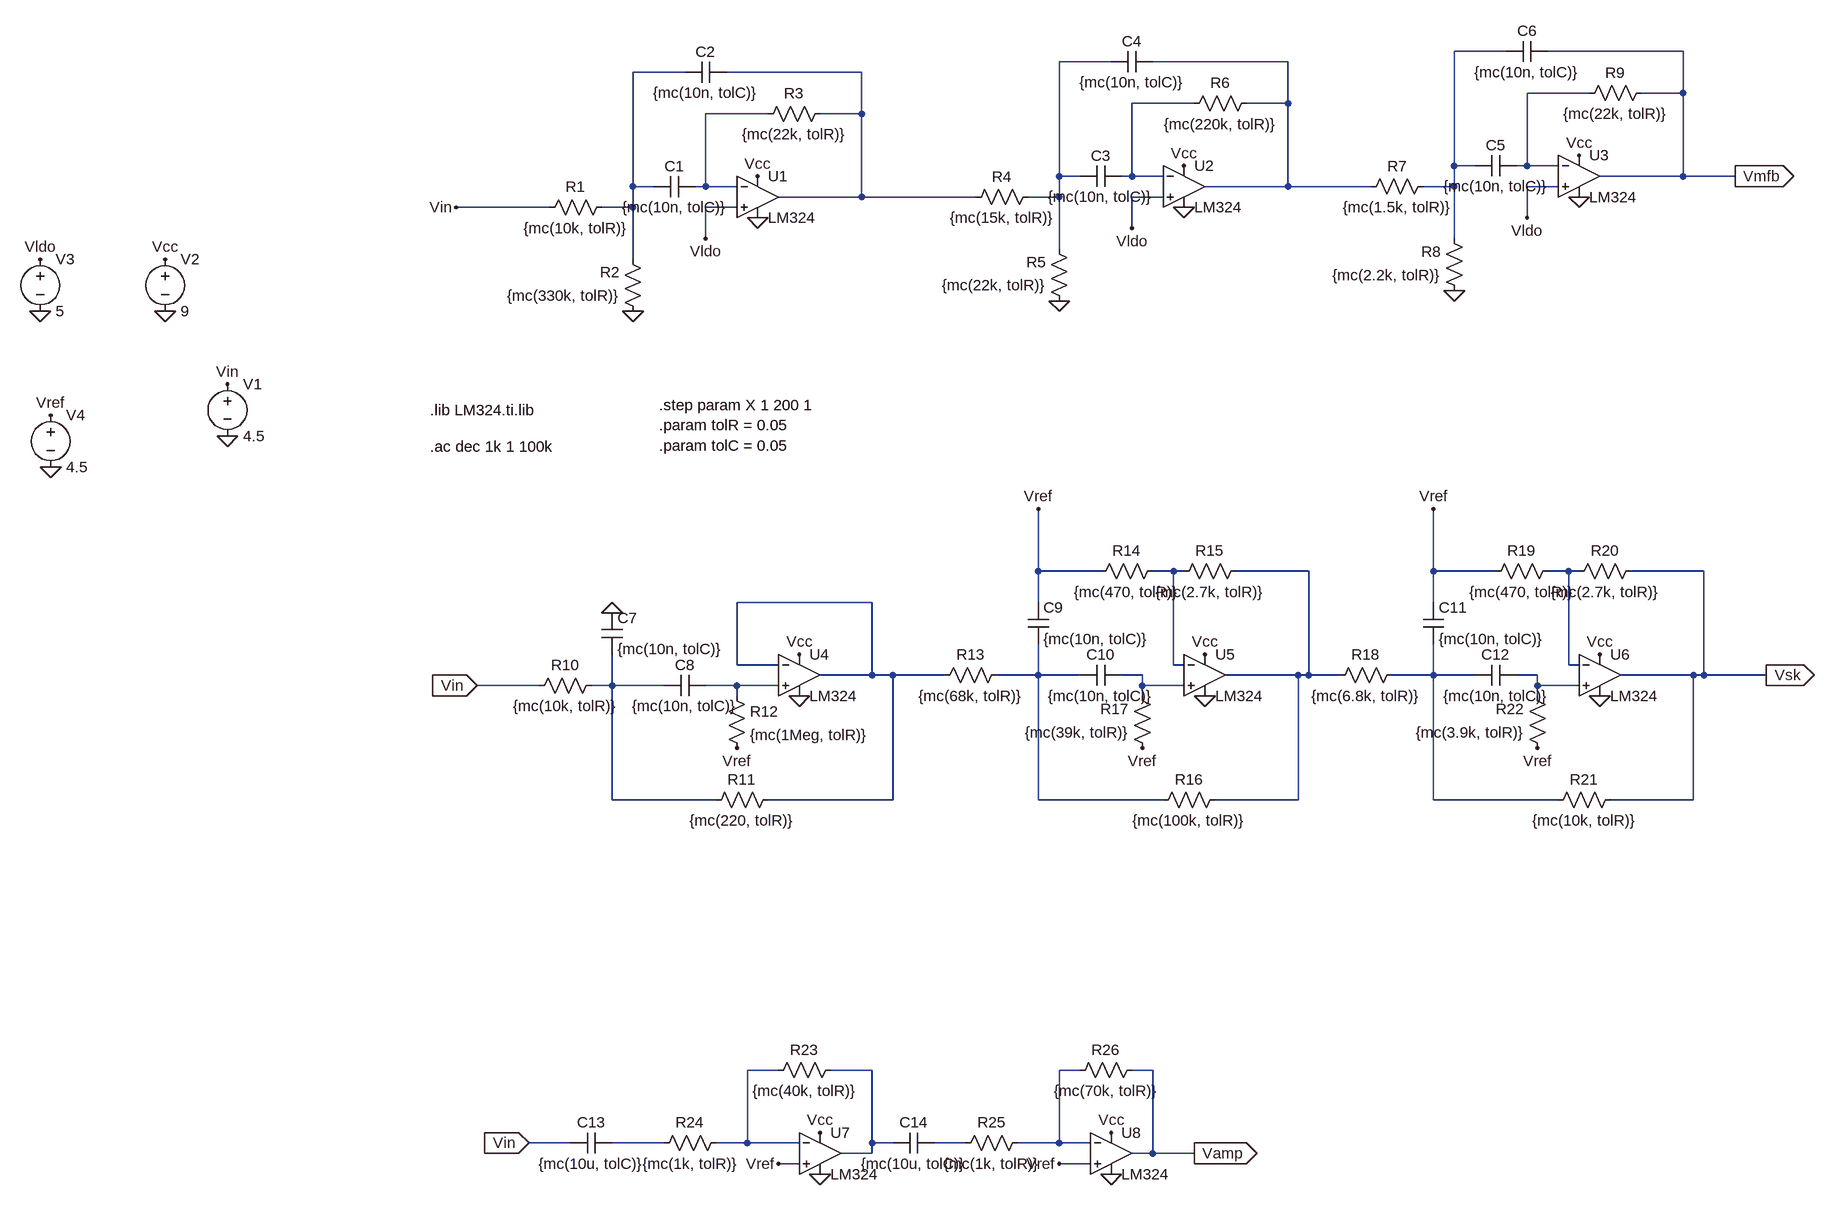
[diagram p0: schematic Draft2.asc]
Draft2.asc, the LTspice schematic file:
Version 4
SHEET 1 1588 1872
WIRE 1088 112 1008 112
WIRE 1360 112 1152 112
WIRE 480 128 400 128
WIRE 752 128 544 128
WIRE -176 144 -256 144
WIRE 96 144 -112 144
WIRE 1216 176 1120 176
WIRE 1360 176 1360 112
WIRE 1360 176 1296 176
WIRE 608 192 512 192
WIRE 752 192 752 128
WIRE 752 192 688 192
WIRE -48 208 -144 208
WIRE 96 208 96 144
WIRE 96 208 32 208
WIRE 1008 288 1008 112
WIRE 1040 288 1008 288
WIRE 1120 288 1120 176
WIRE 1120 288 1104 288
WIRE 1168 288 1120 288
WIRE 400 304 400 128
WIRE 432 304 400 304
WIRE 512 304 512 192
WIRE 512 304 496 304
WIRE 560 304 512 304
WIRE 1360 304 1360 176
WIRE 1360 304 1232 304
WIRE 1440 304 1360 304
WIRE -256 320 -256 144
WIRE -224 320 -256 320
WIRE -144 320 -144 208
WIRE -144 320 -160 320
WIRE -96 320 -144 320
WIRE 752 320 752 192
WIRE 752 320 624 320
WIRE 880 320 752 320
WIRE 1008 320 1008 288
WIRE 1008 320 960 320
WIRE 1168 320 1120 320
WIRE 96 336 96 208
WIRE 96 336 -32 336
WIRE 272 336 96 336
WIRE 400 336 400 304
WIRE 400 336 352 336
WIRE 560 336 512 336
WIRE -384 352 -528 352
WIRE -256 352 -256 320
WIRE -256 352 -304 352
WIRE -96 352 -144 352
WIRE 1120 368 1120 320
WIRE 512 384 512 336
WIRE -144 400 -144 352
WIRE 1008 400 1008 320
WIRE 400 416 400 336
WIRE -256 432 -256 352
WIRE 368 912 368 816
WIRE 464 912 368 912
WIRE 576 912 544 912
WIRE 592 912 576 912
WIRE 784 912 672 912
WIRE 976 912 976 816
WIRE 1072 912 976 912
WIRE 1184 912 1152 912
WIRE 1200 912 1184 912
WIRE 1392 912 1280 912
WIRE 112 960 -96 960
WIRE 368 960 368 912
WIRE 976 960 976 912
WIRE -96 1056 -96 960
WIRE -32 1056 -96 1056
WIRE 576 1056 576 912
WIRE 592 1056 576 1056
WIRE 1184 1056 1184 912
WIRE 1200 1056 1184 1056
WIRE 112 1072 112 960
WIRE 112 1072 32 1072
WIRE 144 1072 112 1072
WIRE 224 1072 144 1072
WIRE 368 1072 368 1024
WIRE 368 1072 304 1072
WIRE 432 1072 368 1072
WIRE 528 1072 496 1072
WIRE 768 1072 656 1072
WIRE 784 1072 784 912
WIRE 784 1072 768 1072
WIRE 832 1072 784 1072
WIRE 976 1072 976 1024
WIRE 976 1072 912 1072
WIRE 1040 1072 976 1072
WIRE 1136 1072 1104 1072
WIRE 1376 1072 1264 1072
WIRE 1392 1072 1392 912
WIRE 1392 1072 1376 1072
WIRE 1488 1072 1392 1072
WIRE -400 1088 -496 1088
WIRE -288 1088 -288 1040
WIRE -288 1088 -320 1088
WIRE -208 1088 -288 1088
WIRE -96 1088 -144 1088
WIRE -32 1088 -96 1088
WIRE 528 1088 528 1072
WIRE 592 1088 528 1088
WIRE 1136 1088 1136 1072
WIRE 1200 1088 1136 1088
WIRE -96 1104 -96 1088
WIRE 528 1104 528 1088
WIRE 1136 1104 1136 1088
WIRE -288 1264 -288 1088
WIRE -128 1264 -288 1264
WIRE 144 1264 144 1072
WIRE 144 1264 -48 1264
WIRE 368 1264 368 1072
WIRE 560 1264 368 1264
WIRE 768 1264 768 1072
WIRE 768 1264 640 1264
WIRE 976 1264 976 1072
WIRE 1168 1264 976 1264
WIRE 1376 1264 1376 1072
WIRE 1376 1264 1248 1264
WIRE -32 1680 -80 1680
WIRE 112 1680 48 1680
WIRE 432 1680 400 1680
WIRE 544 1680 512 1680
WIRE -352 1792 -416 1792
WIRE -208 1792 -288 1792
WIRE -80 1792 -80 1680
WIRE -80 1792 -128 1792
WIRE 0 1792 -80 1792
WIRE 112 1792 112 1680
WIRE 144 1792 112 1792
WIRE 256 1792 208 1792
WIRE 400 1792 400 1680
WIRE 400 1792 336 1792
WIRE 448 1792 400 1792
WIRE 112 1808 112 1792
WIRE 112 1808 64 1808
WIRE 544 1808 544 1680
WIRE 544 1808 512 1808
WIRE 608 1808 544 1808
WIRE 0 1824 -32 1824
WIRE 448 1824 400 1824
FLAG -64 304 Vcc
FLAG -64 368 0
FLAG 592 288 Vcc
FLAG 592 352 0
FLAG 1200 272 Vcc
FLAG 1200 336 0
FLAG 1440 304 Vmfb
IOPIN 1440 304 Out
FLAG 1008 480 0
FLAG 400 496 0
FLAG -256 512 0
FLAG -144 400 Vldo
FLAG 512 384 Vldo
FLAG 1120 368 Vldo
FLAG -880 704 0
FLAG -288 976 0
FLAG 0 1104 0
FLAG 0 1040 Vcc
FLAG 1488 1072 Vsk
IOPIN 1488 1072 Out
FLAG -496 1088 Vin
IOPIN -496 1088 In
FLAG 624 1104 0
FLAG 624 1040 Vcc
FLAG 1232 1104 0
FLAG 1232 1040 Vcc
FLAG 368 816 Vref
FLAG 976 816 Vref
FLAG 528 1184 Vref
FLAG -96 1184 Vref
FLAG 1136 1184 Vref
FLAG -976 512 0
FLAG -976 432 Vcc
FLAG -1168 512 0
FLAG -1168 432 Vldo
FLAG -1152 752 0
FLAG -1152 672 Vref
FLAG -880 624 Vin
FLAG -528 352 Vin
FLAG 32 1840 0
FLAG 480 1840 0
FLAG 32 1776 Vcc
FLAG 480 1776 Vcc
FLAG -32 1824 Vref
FLAG 400 1824 Vref
FLAG -416 1792 Vin
IOPIN -416 1792 In
FLAG 608 1808 Vamp
IOPIN 608 1808 Out
SYMBOL res -288 336 R90
WINDOW 0 0 56 VBottom 2
WINDOW 3 32 56 VTop 2
SYMATTR InstName R1
SYMATTR Value {mc(10k, tolR)}
SYMBOL res -240 528 R180
WINDOW 0 36 76 Left 2
WINDOW 3 36 40 Left 2
SYMATTR InstName R2
SYMATTR Value {mc(330k, tolR)}
SYMBOL cap -160 304 R90
WINDOW 0 0 32 VBottom 2
WINDOW 3 32 32 VTop 2
SYMATTR InstName C1
SYMATTR Value {mc(10n, tolC)}
SYMBOL res 48 192 R90
WINDOW 0 0 56 VBottom 2
WINDOW 3 32 56 VTop 2
SYMATTR InstName R3
SYMATTR Value {mc(22k, tolR)}
SYMBOL cap -112 128 R90
WINDOW 0 0 32 VBottom 2
WINDOW 3 32 32 VTop 2
SYMATTR InstName C2
SYMATTR Value {mc(10n, tolC)}
SYMBOL res 368 320 R90
WINDOW 0 0 56 VBottom 2
WINDOW 3 32 56 VTop 2
SYMATTR InstName R4
SYMATTR Value {mc(15k, tolR)}
SYMBOL res 416 512 R180
WINDOW 0 36 76 Left 2
WINDOW 3 36 40 Left 2
SYMATTR InstName R5
SYMATTR Value {mc(22k, tolR)}
SYMBOL cap 496 288 R90
WINDOW 0 0 32 VBottom 2
WINDOW 3 32 32 VTop 2
SYMATTR InstName C3
SYMATTR Value {mc(10n, tolC)}
SYMBOL res 704 176 R90
WINDOW 0 0 56 VBottom 2
WINDOW 3 32 56 VTop 2
SYMATTR InstName R6
SYMATTR Value {mc(220k, tolR)}
SYMBOL cap 544 112 R90
WINDOW 0 0 32 VBottom 2
WINDOW 3 32 32 VTop 2
SYMATTR InstName C4
SYMATTR Value {mc(10n, tolC)}
SYMBOL res 976 304 R90
WINDOW 0 0 56 VBottom 2
WINDOW 3 32 56 VTop 2
SYMATTR InstName R7
SYMATTR Value {mc(1.5k, tolR)}
SYMBOL res 1024 496 R180
WINDOW 0 36 76 Left 2
WINDOW 3 36 40 Left 2
SYMATTR InstName R8
SYMATTR Value {mc(2.2k, tolR)}
SYMBOL cap 1104 272 R90
WINDOW 0 0 32 VBottom 2
WINDOW 3 32 32 VTop 2
SYMATTR InstName C5
SYMATTR Value {mc(10n, tolC)}
SYMBOL res 1312 160 R90
WINDOW 0 0 56 VBottom 2
WINDOW 3 32 56 VTop 2
SYMATTR InstName R9
SYMATTR Value {mc(22k, tolR)}
SYMBOL cap 1152 96 R90
WINDOW 0 0 32 VBottom 2
WINDOW 3 32 32 VTop 2
SYMATTR InstName C6
SYMATTR Value {mc(10n, tolC)}
SYMBOL opamp2 -64 272 R0
SYMATTR InstName U1
SYMATTR Value LM324
SYMBOL opamp2 592 256 R0
SYMATTR InstName U2
SYMATTR Value LM324
SYMBOL opamp2 1200 240 R0
SYMATTR InstName U3
SYMATTR Value LM324
SYMBOL Voltage -880 608 R0
SYMATTR InstName V1
SYMATTR Value 4.5
SYMATTR Value2 AC 1 0
SYMBOL Res -304 1072 R90
WINDOW 0 0 56 VBottom 2
WINDOW 3 32 56 VTop 2
SYMATTR InstName R10
SYMATTR Value {mc(10k, tolR)}
SYMBOL Res -32 1248 R90
WINDOW 0 0 56 VBottom 2
WINDOW 3 32 56 VTop 2
SYMATTR InstName R11
SYMATTR Value {mc(220, tolR)}
SYMBOL Cap -304 976 R0
SYMATTR InstName C7
SYMATTR Value {mc(10n, tolC)}
SYMBOL Cap -144 1072 R90
WINDOW 0 0 32 VBottom 2
WINDOW 3 32 32 VTop 2
SYMATTR InstName C8
SYMATTR Value {mc(10n, tolC)}
SYMBOL Res -112 1088 R0
SYMATTR InstName R12
SYMATTR Value {mc(1Meg, tolR)}
SYMBOL Res 320 1056 R90
WINDOW 0 0 56 VBottom 2
WINDOW 3 32 56 VTop 2
SYMATTR InstName R13
SYMATTR Value {mc(68k, tolR)}
SYMBOL Res 560 896 R90
WINDOW 0 0 56 VBottom 2
WINDOW 3 32 56 VTop 2
SYMATTR InstName R14
SYMATTR Value {mc(470, tolR)}
SYMBOL Res 688 896 R90
WINDOW 0 0 56 VBottom 2
WINDOW 3 32 56 VTop 2
SYMATTR InstName R15
SYMATTR Value {mc(2.7k, tolR)}
SYMBOL Res 656 1248 R90
WINDOW 0 0 56 VBottom 2
WINDOW 3 32 56 VTop 2
SYMATTR InstName R16
SYMATTR Value {mc(100k, tolR)}
SYMBOL Res 544 1200 R180
WINDOW 0 36 76 Left 2
WINDOW 3 36 40 Left 2
SYMATTR InstName R17
SYMATTR Value {mc(39k, tolR)}
SYMBOL Cap 352 960 R0
SYMATTR InstName C9
SYMATTR Value {mc(10n, tolC)}
SYMBOL Cap 496 1056 R90
WINDOW 0 0 32 VBottom 2
WINDOW 3 32 32 VTop 2
SYMATTR InstName C10
SYMATTR Value {mc(10n, tolC)}
SYMBOL Res 928 1056 R90
WINDOW 0 0 56 VBottom 2
WINDOW 3 32 56 VTop 2
SYMATTR InstName R18
SYMATTR Value {mc(6.8k, tolR)}
SYMBOL Res 1168 896 R90
WINDOW 0 0 56 VBottom 2
WINDOW 3 32 56 VTop 2
SYMATTR InstName R19
SYMATTR Value {mc(470, tolR)}
SYMBOL Res 1296 896 R90
WINDOW 0 0 56 VBottom 2
WINDOW 3 32 56 VTop 2
SYMATTR InstName R20
SYMATTR Value {mc(2.7k, tolR)}
SYMBOL Res 1264 1248 R90
WINDOW 0 0 56 VBottom 2
WINDOW 3 32 56 VTop 2
SYMATTR InstName R21
SYMATTR Value {mc(10k, tolR)}
SYMBOL Res 1152 1200 R180
WINDOW 0 36 76 Left 2
WINDOW 3 36 40 Left 2
SYMATTR InstName R22
SYMATTR Value {mc(3.9k, tolR)}
SYMBOL Cap 960 960 R0
SYMATTR InstName C11
SYMATTR Value {mc(10n, tolC)}
SYMBOL Cap 1104 1056 R90
WINDOW 0 0 32 VBottom 2
WINDOW 3 32 32 VTop 2
SYMATTR InstName C12
SYMATTR Value {mc(10n, tolC)}
SYMBOL opamp2 0 1008 R0
SYMATTR InstName U4
SYMATTR Value LM324
SYMBOL opamp2 624 1008 R0
SYMATTR InstName U5
SYMATTR Value LM324
SYMBOL opamp2 1232 1008 R0
SYMATTR InstName U6
SYMATTR Value LM324
SYMBOL voltage -976 416 R0
WINDOW 123 0 0 Left 0
WINDOW 39 0 0 Left 0
SYMATTR InstName V2
SYMATTR Value 9
SYMBOL Voltage -1168 416 R0
SYMATTR InstName V3
SYMATTR Value 5
SYMBOL Voltage -1152 656 R0
SYMATTR InstName V4
SYMATTR Value 4.5
SYMBOL Res 64 1664 R90
WINDOW 0 0 56 VBottom 2
WINDOW 3 32 56 VTop 2
SYMATTR InstName R23
SYMATTR Value {mc(40k, tolR)}
SYMBOL Res -112 1776 R90
WINDOW 0 0 56 VBottom 2
WINDOW 3 32 56 VTop 2
SYMATTR InstName R24
SYMATTR Value {mc(1k, tolR)}
SYMBOL Res 352 1776 R90
WINDOW 0 0 56 VBottom 2
WINDOW 3 32 56 VTop 2
SYMATTR InstName R25
SYMATTR Value {mc(1k, tolR)}
SYMBOL Res 528 1664 R90
WINDOW 0 0 56 VBottom 2
WINDOW 3 32 56 VTop 2
SYMATTR InstName R26
SYMATTR Value {mc(70k, tolR)}
SYMBOL Cap -288 1776 R90
WINDOW 0 0 32 VBottom 2
WINDOW 3 32 32 VTop 2
SYMATTR InstName C13
SYMATTR Value {mc(10u, tolC)}
SYMBOL Cap 208 1776 R90
WINDOW 0 0 32 VBottom 2
WINDOW 3 32 32 VTop 2
SYMATTR InstName C14
SYMATTR Value {mc(10u, tolC)}
SYMBOL opamp2 32 1744 R0
SYMATTR InstName U7
SYMATTR Value LM324
SYMBOL opamp2 480 1744 R0
SYMATTR InstName U8
SYMATTR Value LM324
TEXT -568 664 Left 2 !.lib LM324.ti.lib
TEXT -568 720 Left 2 !.ac dec 1k 1 100k
TEXT -216 656 Left 2 !.step param X 1 200 1\n.param tolR = 0.05\n.param tolC = 0.05

The netlist it stands for:
* Draft2.asc
R1 N004 Vin {mc(10k, tolR)}
R2 0 N004 {mc(330k, tolR)}
C1 N008 N004 {mc(10n, tolC)}
R3 N005 N008 {mc(22k, tolR)}
C2 N005 N004 {mc(10n, tolC)}
R4 N002 N005 {mc(15k, tolR)}
R5 0 N002 {mc(22k, tolR)}
C3 N007 N002 {mc(10n, tolC)}
R6 N003 N007 {mc(220k, tolR)}
C4 N003 N002 {mc(10n, tolC)}
R7 N001 N003 {mc(1.5k, tolR)}
R8 0 N001 {mc(2.2k, tolR)}
C5 N006 N001 {mc(10n, tolC)}
R9 Vmfb N006 {mc(22k, tolR)}
C6 Vmfb N001 {mc(10n, tolC)}
XU1 Vldo N008 Vcc 0 N005 LM324  ; pins In+ In- V+ V- OUT
XU2 Vldo N007 Vcc 0 N003 LM324  ; pins In+ In- V+ V- OUT
XU3 Vldo N006 Vcc 0 Vmfb LM324  ; pins In+ In- V+ V- OUT
V1 Vin 0 4.5 AC 1 0
R10 N017 Vin {mc(10k, tolR)}
R11 N012 N017 {mc(220, tolR)}
C7 0 N017 {mc(10n, tolC)}
C8 N018 N017 {mc(10n, tolC)}
R12 N018 Vref {mc(1Meg, tolR)}
R13 N013 N012 {mc(68k, tolR)}
R14 N009 Vref {mc(470, tolR)}
R15 N010 N009 {mc(2.7k, tolR)}
R16 N010 N013 {mc(100k, tolR)}
R17 Vref N014 {mc(39k, tolR)}
C9 Vref N013 {mc(10n, tolC)}
C10 N014 N013 {mc(10n, tolC)}
R18 N015 N010 {mc(6.8k, tolR)}
R19 N011 Vref {mc(470, tolR)}
R20 Vsk N011 {mc(2.7k, tolR)}
R21 Vsk N015 {mc(10k, tolR)}
R22 Vref N016 {mc(3.9k, tolR)}
C11 Vref N015 {mc(10n, tolC)}
C12 N016 N015 {mc(10n, tolC)}
XU4 N018 N012 Vcc 0 N012 LM324  ; pins In+ In- V+ V- OUT
XU5 N014 N009 Vcc 0 N010 LM324  ; pins In+ In- V+ V- OUT
XU6 N016 N011 Vcc 0 Vsk LM324  ; pins In+ In- V+ V- OUT
V2 Vcc 0 9
V3 Vldo 0 5
V4 Vref 0 4.5
R23 N020 N019 {mc(40k, tolR)}
R24 N019 N022 {mc(1k, tolR)}
R25 N021 N023 {mc(1k, tolR)}
R26 Vamp N021 {mc(70k, tolR)}
C13 N022 Vin {mc(10u, tolC)}
C14 N023 N020 {mc(10u, tolC)}
XU7 Vref N019 Vcc 0 N020 LM324  ; pins In+ In- V+ V- OUT
XU8 Vref N021 Vcc 0 Vamp LM324  ; pins In+ In- V+ V- OUT
.lib LM324.ti.lib
.ac dec 1k 1 100k
.step param X 1 200 1
.param tolR = 0.05
.param tolC = 0.05
.backanno
.end